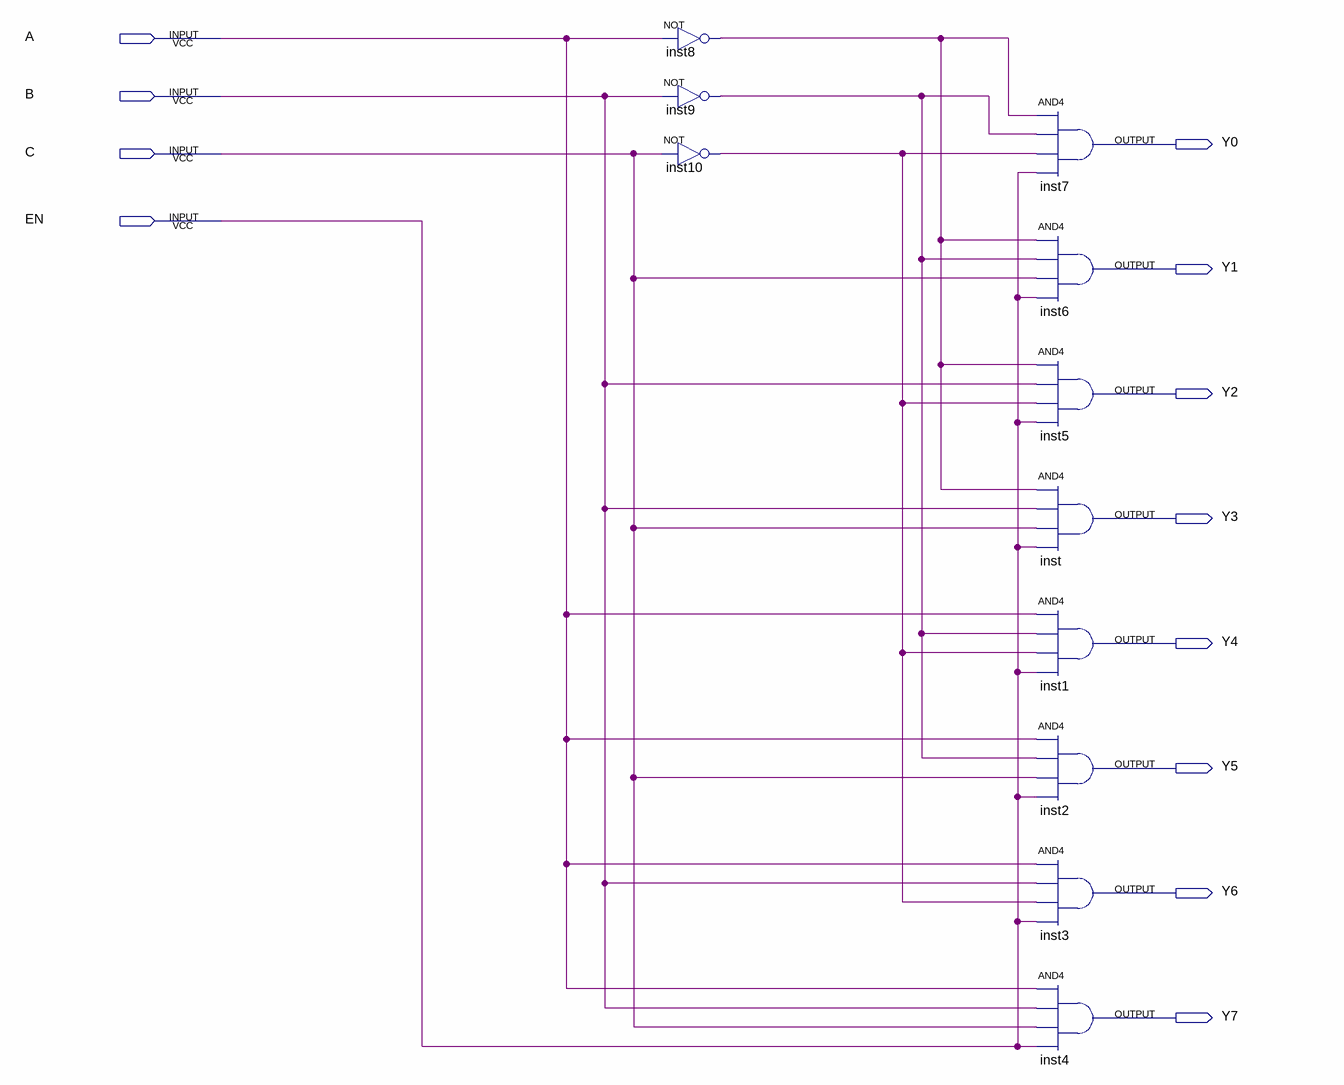
[diagram p0: schematic sheet]
// Quartus schematic DECODER_3_TO_8.bdf as structural Verilog: 11 symbols, 12 pins
module DECODER_3_TO_8 (
  input  A,
  input  B,
  input  C,
  input  EN,
  output Y0,
  output Y1,
  output Y2,
  output Y3,
  output Y4,
  output Y5,
  output Y6,
  output Y7
);

  wire inst8_out, inst9_out, inst10_out;

  not inst8 (inst8_out, A);
  not inst9 (inst9_out, B);
  not inst10 (inst10_out, C);
  and inst7 (Y0, inst8_out, inst9_out, inst10_out, EN);
  and inst6 (Y1, inst8_out, inst9_out, C, EN);
  and inst5 (Y2, inst8_out, B, inst10_out, EN);
  and inst (Y3, inst8_out, B, C, EN);
  and inst1 (Y4, A, inst9_out, inst10_out, EN);
  and inst2 (Y5, A, inst9_out, C, EN);
  and inst3 (Y6, A, B, inst10_out, EN);
  and inst4 (Y7, A, B, C, EN);
endmodule
